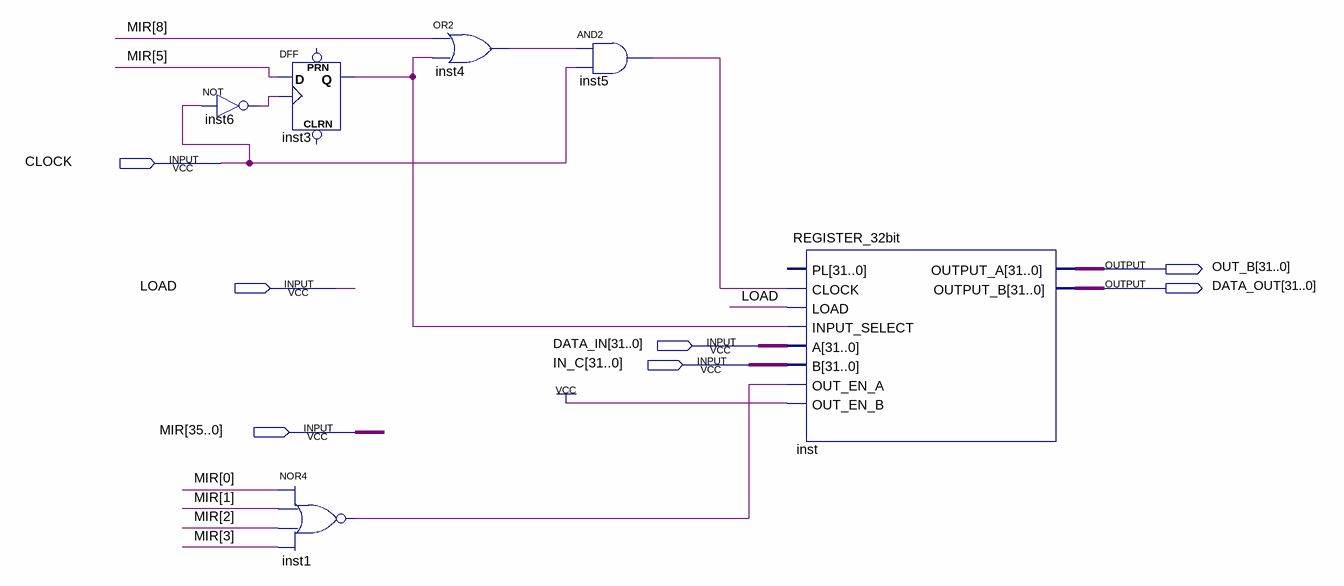
[diagram p0: schematic sheet]
// Quartus schematic MDR.bdf as structural Verilog: 6 symbols, 7 pins
module MDR (
  input  CLOCK,
  input  LOAD,
  input  [31:0] DATA_IN,
  input  [31:0] IN_C,
  input  [35:0] MIR,
  output [31:0] OUT_B,
  output [31:0] DATA_OUT
);

  wire inst1_out, inst3_q, inst4_out, inst5_out, inst6_out;

  not inst6 (inst6_out, CLOCK);
  DFF inst3 (.CLK(inst6_out), .D(MIR[5]), .Q(inst3_q));  // open: CLRN, PRN
  nor inst1 (inst1_out, MIR[0], MIR[1], MIR[2], MIR[3]);
  or inst4 (inst4_out, MIR[8], inst3_q);
  and inst5 (inst5_out, inst4_out, CLOCK);
  REGISTER_32bit inst (
    .CLOCK(inst5_out), .LOAD(LOAD), .INPUT_SELECT(inst3_q), .A(DATA_IN), .B(IN_C), .OUT_EN_A(inst1_out),
    .OUT_EN_B(1'b1), .OUTPUT_A(OUT_B), .OUTPUT_B(DATA_OUT));  // open: PL
endmodule
